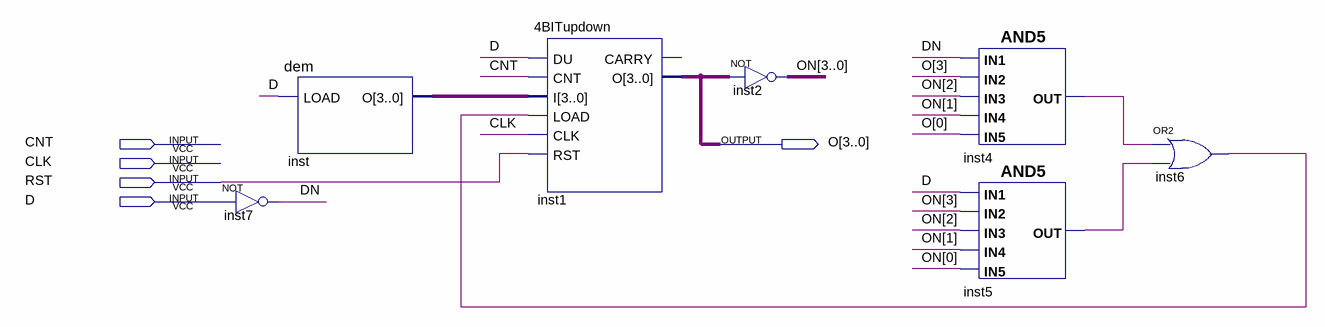
[diagram p0: schematic sheet]
// Quartus schematic BCBCounter.bdf as structural Verilog: 7 symbols, 5 pins
module BCBCounter (
  input  CNT,
  input  CLK,
  input  RST,
  input  D,
  output [3:0] O
);

  wire DN, inst4_out, inst5_out, inst6_out;
  wire [3:0] inst_o, ON;

  dem inst (.LOAD(D), .O(inst_o));
  not inst7 (DN, D);
  \4BITupdown  inst1 (.DU(D), .CNT(CNT), .I(inst_o), .LOAD(inst6_out), .CLK(CLK), .RST(RST), .O(O));  // open: CARRY
  assign ON = ~O;  // NOT inst2, 4 bits wide
  and inst4 (inst4_out, DN, O[3], ON[2], ON[1], O[0]);
  and inst5 (inst5_out, D, ON[3], ON[2], ON[1], ON[0]);
  or inst6 (inst6_out, inst4_out, inst5_out);
endmodule
